# Altium schematic sheet Sheet1.SchDoc
size 594 x 420 mm; Organization: ФЕЛ, ДК-82; DocumentNumber: 1; SheetNumber: 1; SheetTotal: 1
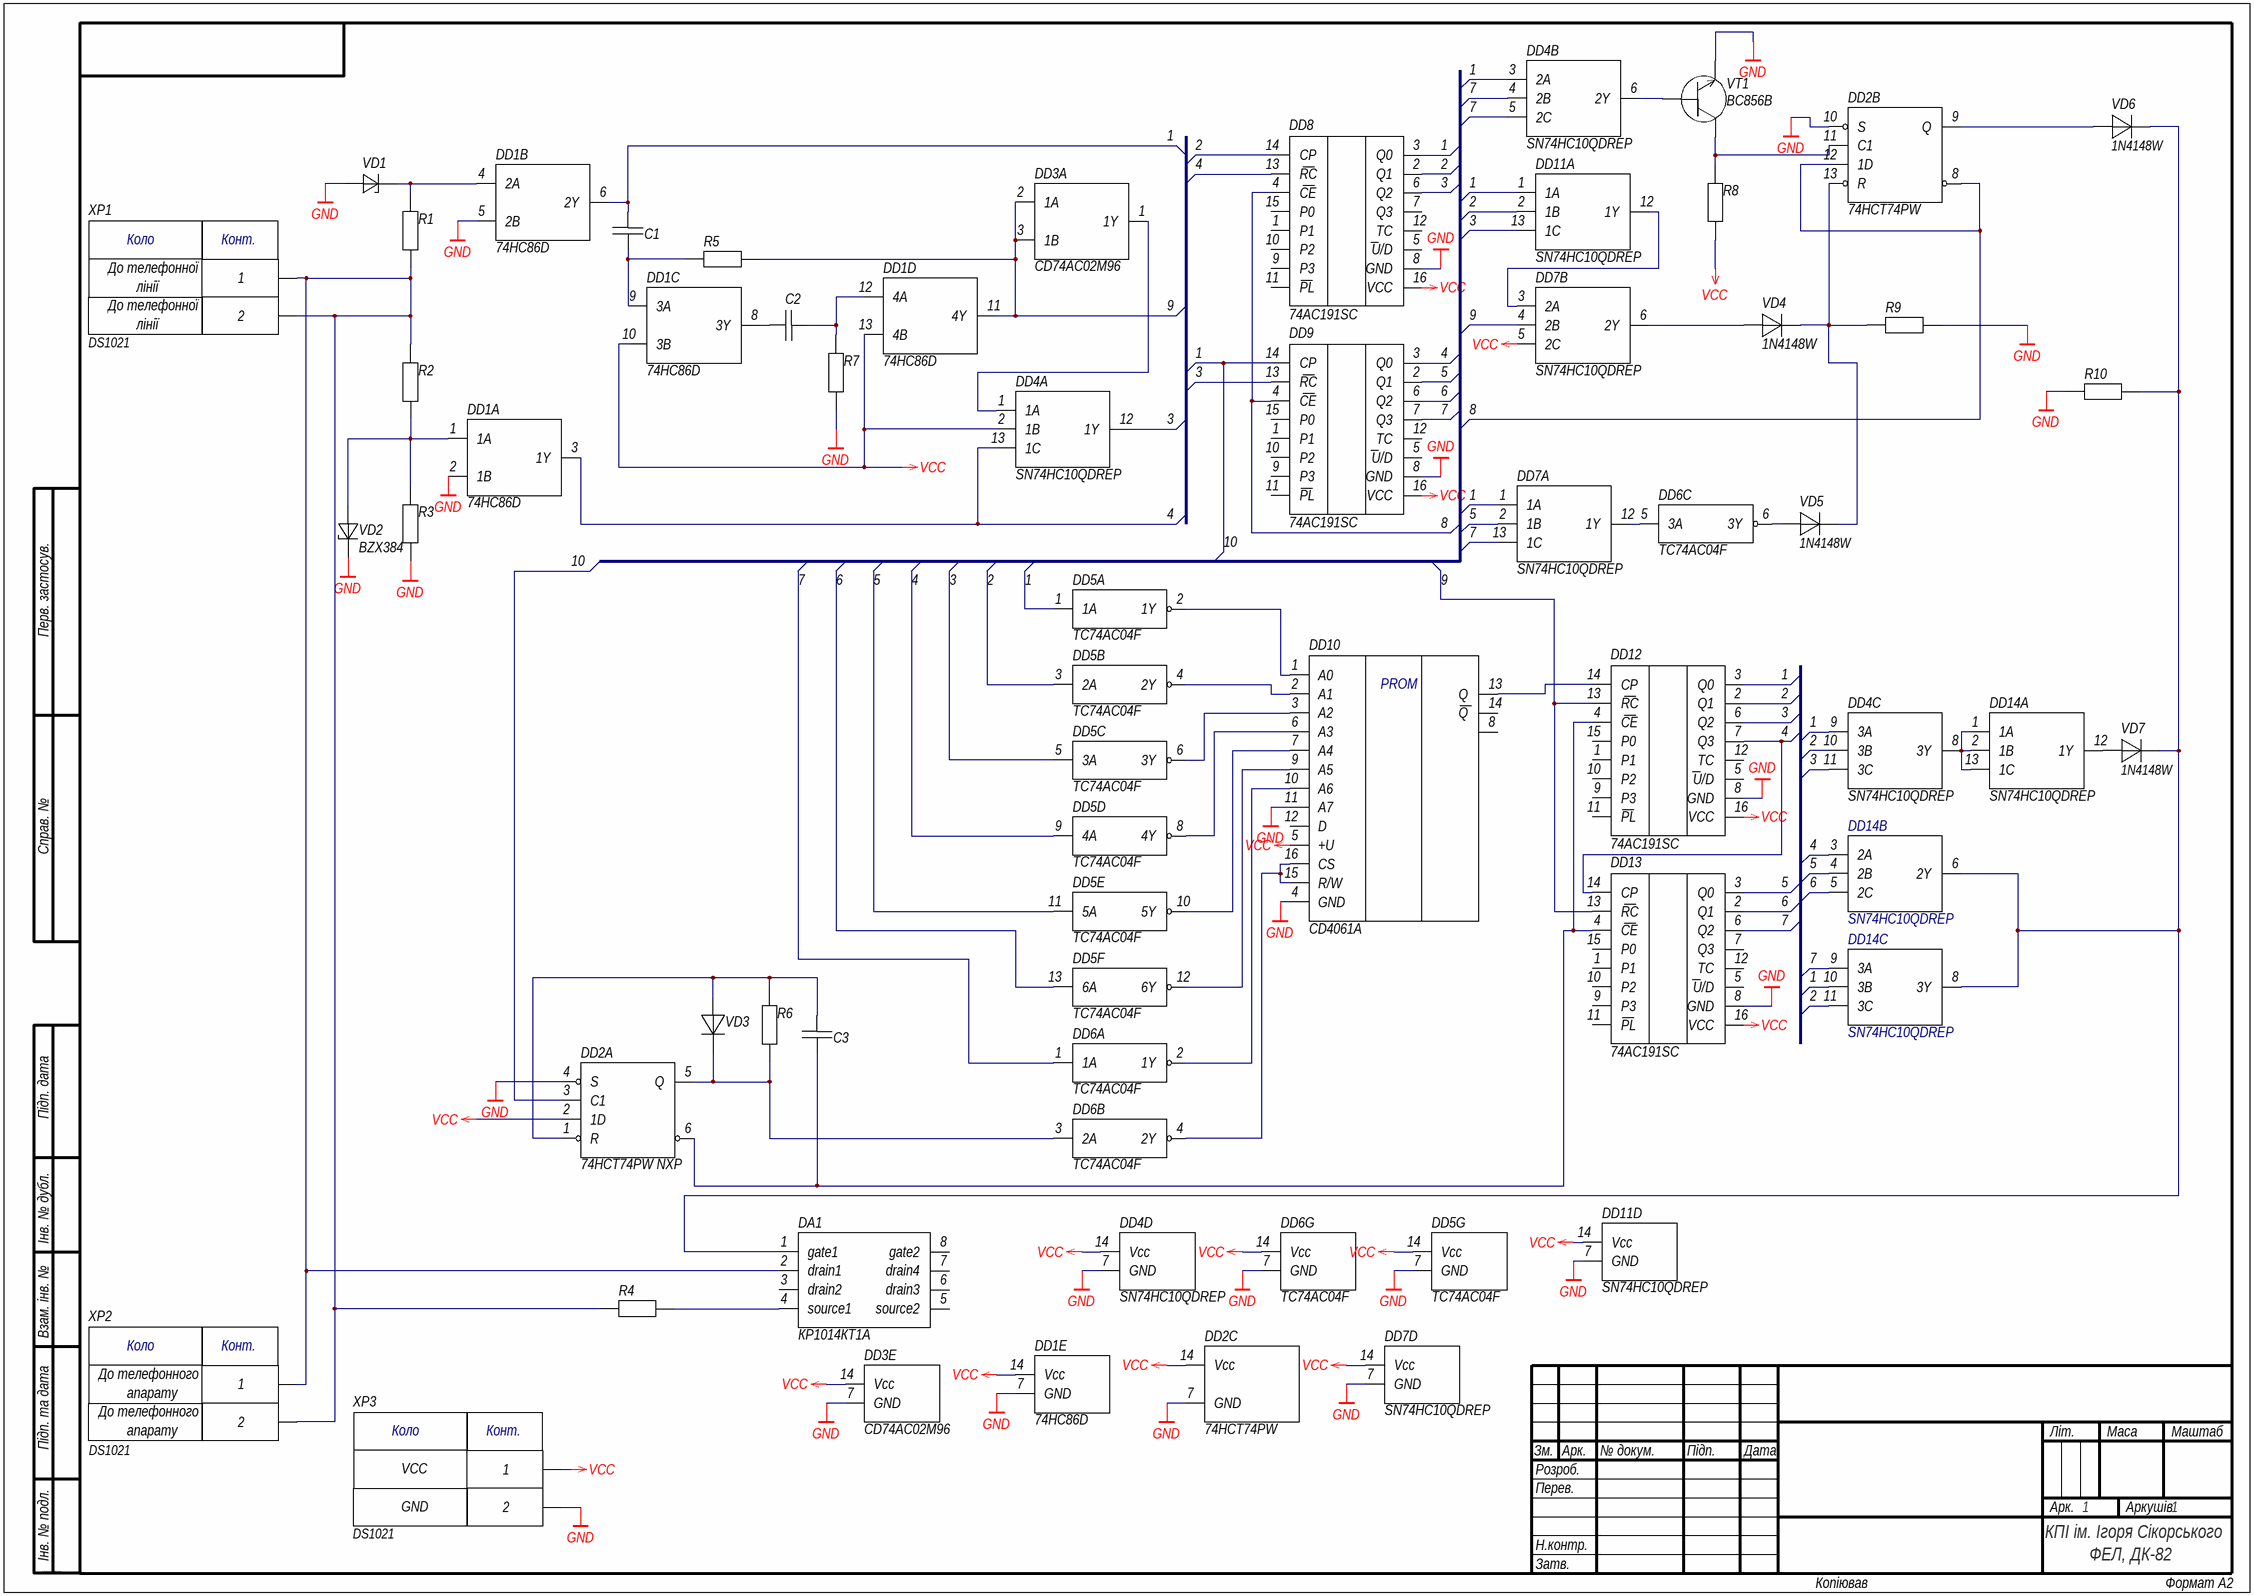
[diagram p0: Sheet1.SchDoc]

## Parts
C1  С-0805 50 В 1 мкФ 10% X7R Hitano  [0805]  (value not drawn)
C2  С-0805 50 В 1 мкФ 10% X7R Hitano  [0805]  (value not drawn)
C3  С-0805 50 В 1 мкФ 10% X7R Hitano  [0805]  (value not drawn)
DA1  КР1014КТ1А Электроника и связь  [DIP8]  (value not drawn)
DD1  74HC86D Philips  [SOIC-14]  (value not drawn)  (parts A,B,C,D,E of 5)
DD2  74HCT74PW NXP  [TSSOP-14]  (parts A,B,C of 3)
DD3  CD74AC02M96 TI  [SOIC-14]  (value not drawn)  (parts A,E of 5)
DD4  SN74HC10QDREP Texas Instruments  [SOIC-14]  (value not drawn)  (parts A,B,C,D of 4)
DD5  TC74AC04F Toshiba  [SOIC-14]  (value not drawn)  (parts A,B,C,D,E,F,G of 7)
DD6  TC74AC04F Toshiba  [SOIC-14]  (value not drawn)  (parts A,B,C,G of 7)
DD7  SN74HC10QDREP Texas Instruments  [SOIC-14]  (value not drawn)  (parts A,B,D of 4)
DD8  74AC191SC Fairchild  [SOIC-16]  (value not drawn)
DD9  74AC191SC Fairchild  [SOIC-16]  (value not drawn)
DD10  CD4061A NXP  [DIP16]  (value not drawn)
DD11  SN74HC10QDREP Texas Instruments  [SOIC-14]  (value not drawn)  (parts A,D of 4)
DD12  74AC191SC Fairchild  [SOIC-16]  (value not drawn)
DD13  74AC191SC Fairchild  [SOIC-16]  (value not drawn)
DD14  SN74HC10QDREP Texas Instruments  [SOIC-14]  (value not drawn)  (parts A,B,C of 4)
R1  R-0805 0,125 Вт 390 кОм 5 % Hitano  [0805]  (value not drawn)
R2  R-0805 0,125 Вт 433,5 кОм 5 % Hitano  [0805]  (value not drawn)
R3  R-0805 0,125 Вт 76,5 кОм 5 % Hitano  [0805]  (value not drawn)
R4  R-0805 0,125 Вт 39 кОм 5 % Hitano  [0805]  (value not drawn)
R5  R-0805 0,125 Вт 100 кОм 5 % Hitano  [0805]  (value not drawn)
R6  R-0805 0,125 Вт 82 кОм 5 % Hitano  [0805]  (value not drawn)
R7  R-0805 0,125 Вт 82 кОм 5 % Hitano  [0805]  (value not drawn)
R8  R-0805 0,125 Вт 100 кОм 5 % Hitano  [0805]  (value not drawn)
R9  R-0805 0,125 Вт 100 кОм 5 % Hitano  [0805]  (value not drawn)
R10  R-0805 0,125 Вт 100 кОм 5 % Hitano  [0805]  (value not drawn)
VD1  BZX384 NXP  [SOD-323]  (value not drawn)
VD2  BZX384 NXP  [SOD-323]  (value not drawn)
VD3  1N4148W Yangjie  [SOD-123]  (value not drawn)
VD4  1N4148W Yangjie  [SOD-123]  (value not drawn)
VD5  1N4148W Yangjie  [SOD-123]  (value not drawn)
VD6  1N4148W Yangjie  [SOD-123]  (value not drawn)
VD7  1N4148W Yangjie  [SOD-123]  (value not drawn)
VT1  BC856B Infineon  [SOT-23]  (value not drawn)
XP1  DS1021 Ningbo Zhenqin Electronic  [PLS-2]  (value not drawn)  (no BOM)
XP2  DS1021 Ningbo Zhenqin Electronic  [PLS-2]  (value not drawn)  (no BOM)
XP3  DS1021 Ningbo Zhenqin Electronic  [PLS-2]  (value not drawn)  (no BOM)

## Nets
GND: DD1.2(1B) DD1.5(2B) DD1.7(GND) DD2.4(S) DD2.7(GND) DD2.10(S) DD3.7(GND) DD4.7(GND) DD5.7(GND) DD6.7(GND) DD7.7(GND) DD8.8(GND) DD9.8(GND) DD10.4(GND) DD10.11(A7) DD11.7(GND) DD12.8(GND) DD13.8(GND) R3.1 R7.2 R9.2 R10.1 VD1.1 VD2.2 VT1.2 XP3.2
VCC: DD1.10(3B) DD1.13(4B) DD1.14(Vcc) DD2.2(1D) DD2.14(Vcc) DD3.14(Vcc) DD4.2(1B) DD4.14(Vcc) DD5.14(Vcc) DD6.14(Vcc) DD7.5(2C) DD7.14(Vcc) DD8.16(VCC) DD9.16(VCC) DD10.5(+U) DD11.14(Vcc) DD12.16(VCC) DD13.16(VCC) R8.2 XP3.1
1: C1.2 DD1.6(2Y) DD2.3(C1) DD4.3(2A) DD4.9(3A) DD5.1(1A) DD7.1(1A) DD8.3(Q0) DD9.14(CP) DD11.1(1A) DD12.3(Q0) DD14.10(3B)  [also labelled 10]
2: DD4.10(3B) DD5.3(2A) DD8.2(Q1) DD8.14(CP) DD11.2(1B) DD12.2(Q1) DD14.11(3C)
3: DD4.11(3C) DD4.12(1Y) DD5.5(3A) DD8.6(Q2) DD9.13(RC) DD11.13(1C) DD12.6(Q2)
4: DD1.3(1Y) DD4.13(1C) DD5.9(4A) DD8.13(RC) DD9.3(Q0) DD12.7(Q3) DD13.14(CP) DD14.3(2A)
5: DD5.11(5A) DD7.2(1B) DD9.2(Q1) DD13.3(Q0) DD14.4(2B)
6: DD5.13(6A) DD9.6(Q2) DD13.2(Q1) DD14.5(2C)
7: DD4.4(2B) DD4.5(2C) DD6.1(1A) DD7.13(1C) DD9.7(Q3) DD13.6(Q2) DD14.9(3A)
8: DD2.8(Q) DD2.12(1D) DD8.4(CE) DD9.4(CE)
9: DD1.11(4Y) DD3.2(1A) DD3.3(1B) DD7.4(2B) DD12.13(RC) DD13.13(RC) R5.2
NetC1_1: C1.1 DD1.9(3A) R5.1
NetC2_1: C2.1 DD1.8(3Y)
NetC2_2: C2.2 DD1.12(4A) R7.1
NetC3_1: C3.1 DD2.6(Q) DD12.4(CE) DD13.4(CE)
NetC3_2: C3.2 DD2.1(R) R6.2 VD3.1
NetDA1_1: DA1.1(gate1) DD14.6(2Y) DD14.8(3Y) R10.2 VD6.2 VD7.2
NetDA1_2: DA1.2(drain1) R1.1 R2.2 R4.1 XP1.1 XP1.2 XP2.1 XP2.2
NetDA1_4: DA1.4(source1) R4.2
NetDD1_1: DD1.1(1A) R2.1 R3.2 VD2.1
NetDD1_4: DD1.4(2A) R1.2 VD1.2
NetDD2_5: DD2.5(Q) DD6.3(2A) R6.1 VD3.2
NetDD2_9: DD2.9(Q) VD6.1
NetDD2_11: DD2.11(C1) R8.1 VT1.3
NetDD2_13: DD2.13(R) R9.1 VD4.2 VD5.2
NetDD3_1: DD3.1(1Y) DD4.1(1A)
NetDD4_6: DD4.6(2Y) VT1.1
NetDD4_8: DD4.8(3Y) DD14.1(1A) DD14.2(1B) DD14.13(1C)
NetDD5_2: DD5.2(1Y) DD10.1(A0)
NetDD5_4: DD5.4(2Y) DD10.2(A1)
NetDD5_6: DD5.6(3Y) DD10.3(A2)
NetDD5_8: DD5.8(4Y) DD10.6(A3)
NetDD5_10: DD5.10(5Y) DD10.7(A4)
NetDD5_12: DD5.12(6Y) DD10.9(A5)
NetDD6_2: DD6.2(1Y) DD10.10(A6)
NetDD6_4: DD6.4(2Y) DD10.15(R/W) DD10.16(CS)
NetDD6_5: DD6.5(3A) DD7.12(1Y)
NetDD6_6: DD6.6(3Y) VD5.1
NetDD7_3: DD7.3(2A) DD11.12(1Y)
NetDD7_6: DD7.6(2Y) VD4.1
NetDD10_13: DD10.13(Q) DD12.14(CP)
NetDD14_12: DD14.12(1Y) VD7.1

Not connected (* = marked no-connect by the designer): DA1 3(drain2) 5(source2) 6(drain3) 7(drain4) 8(gate2); DD8 1(P1) 5(U/D) 7(Q3) 9(P3) 10(P2) 11(PL) 12(TC) 15(P0); DD9 1(P1) 5(U/D) 9(P3) 10(P2) 11(PL) 12(TC) 15(P0); DD10 8 12(D) 14(Q); DD12 1(P1) 5(U/D) 9(P3) 10(P2) 11(PL) 12(TC) 15(P0); DD13 1(P1) 5(U/D) 7(Q3) 9(P3) 10(P2) 11(PL) 12(TC) 15(P0)

## Notes on the sheet
- До телефонної
- лінії
- До телефонного
- апарату
- VCC
- GND
- Перв. застосув.
- Справ. №
- Підп. дата
- Інв. № дубл.
- Взам. інв. №
- Підп. та дата
- Зм.
- Розроб.
- Арк.
- № докум.
- Підп.
- Дата
- Літ.
- Маса
- Маштаб
- Перев.
- Аркушів
- Інв. № подл.
- Н.контр.
- Затв.
- КПІ ім. Ігоря Сікорського
- ALTIUM GOSTBOM2.0 KEV
- Копіював
- Формат А2
- (in symbol CD4061A) PROM
- (in symbol DS1021) Коло; Конт.

## Library data of the parts
C1-C3 = C-0805 1 мкФ: Value: 1 мкФ; Voltage: 50 В; Package: С-0805; Temp_Coef: X7R; Tolerance: 10%; Manufacturer: Hitano
DA1 = КР1014КТ1А: Name: КР1014КТ1А; Manufacturer: Электроника и связь
DD1 = 74HC86D: OR; Name: 74HC86D; Manufacturer: Philips
DD2 = 74HCT74PW: DUAL D FF POSEDG TRIG; Name: 74HCT74PW; Manufacturer: NXP
DD3 = CD74AC02M96: 2-INPUT NOR GATE; Name: CD74AC02M96; Manufacturer: TI
DD4 DD7 DD11 DD14 = SN74HC10QDREP: 3-INPUT NAND GATE; Name: SN74HC10QDREP; Manufacturer: Texas Instruments
DD5 DD6 = TC74AC04F: NOT; Name: TC74AC04F; Manufacturer: Toshiba
DD8 DD9 DD12 DD13 = 74AC191SC: Counter; Name: 74AC191SC; Manufacturer: Fairchild
DD10 = CD4061A: Name: CD4061A; Manufacturer: NXP
R1 = R-0805 390 кОм: Value: 390 кОм; Tolerance: 5 %; Package: R-0805; Power: 0,125 Вт; Manufacturer: Hitano
R2 = R-0805 433,5 кОм: Tolerance: 5 %; Value: 433,5 кОм; Package: R-0805; Power: 0,125 Вт; Manufacturer: Hitano
R3 = R-0805 76,5 кОм: Tolerance: 5 %; Value: 76,5 кОм; Package: R-0805; Power: 0,125 Вт; Manufacturer: Hitano
R4 = R-0805 39 кОм: Value: 39 кОм; Tolerance: 5 %; Package: R-0805; Power: 0,125 Вт; Manufacturer: Hitano
R5 R8-R10 = R-0805 100 кОм: Value: 100 кОм; Tolerance: 5 %; Package: R-0805; Power: 0,125 Вт; Manufacturer: Hitano
R6 R7 = R-0805 82 кОм: Value: 82 кОм; Tolerance: 5 %; Package: R-0805; Power: 0,125 Вт; Manufacturer: Hitano
VD1 VD2 = BZX384: Name: BZX384; Manufacturer: NXP
VD3-VD7 = 1N4148W: Manufacturer: Yangjie; Name: 1N4148W
VT1 = BC856B: Name: BC856B; Manufacturer: Infineon
XP1-XP3 = DS1021: PLS-2_1x2; Manufacturer: Ningbo Zhenqin Electronic; Name: DS1021